# Altium schematic sheet ESQUEMATICOS1.SchDoc (part 2 of 2)
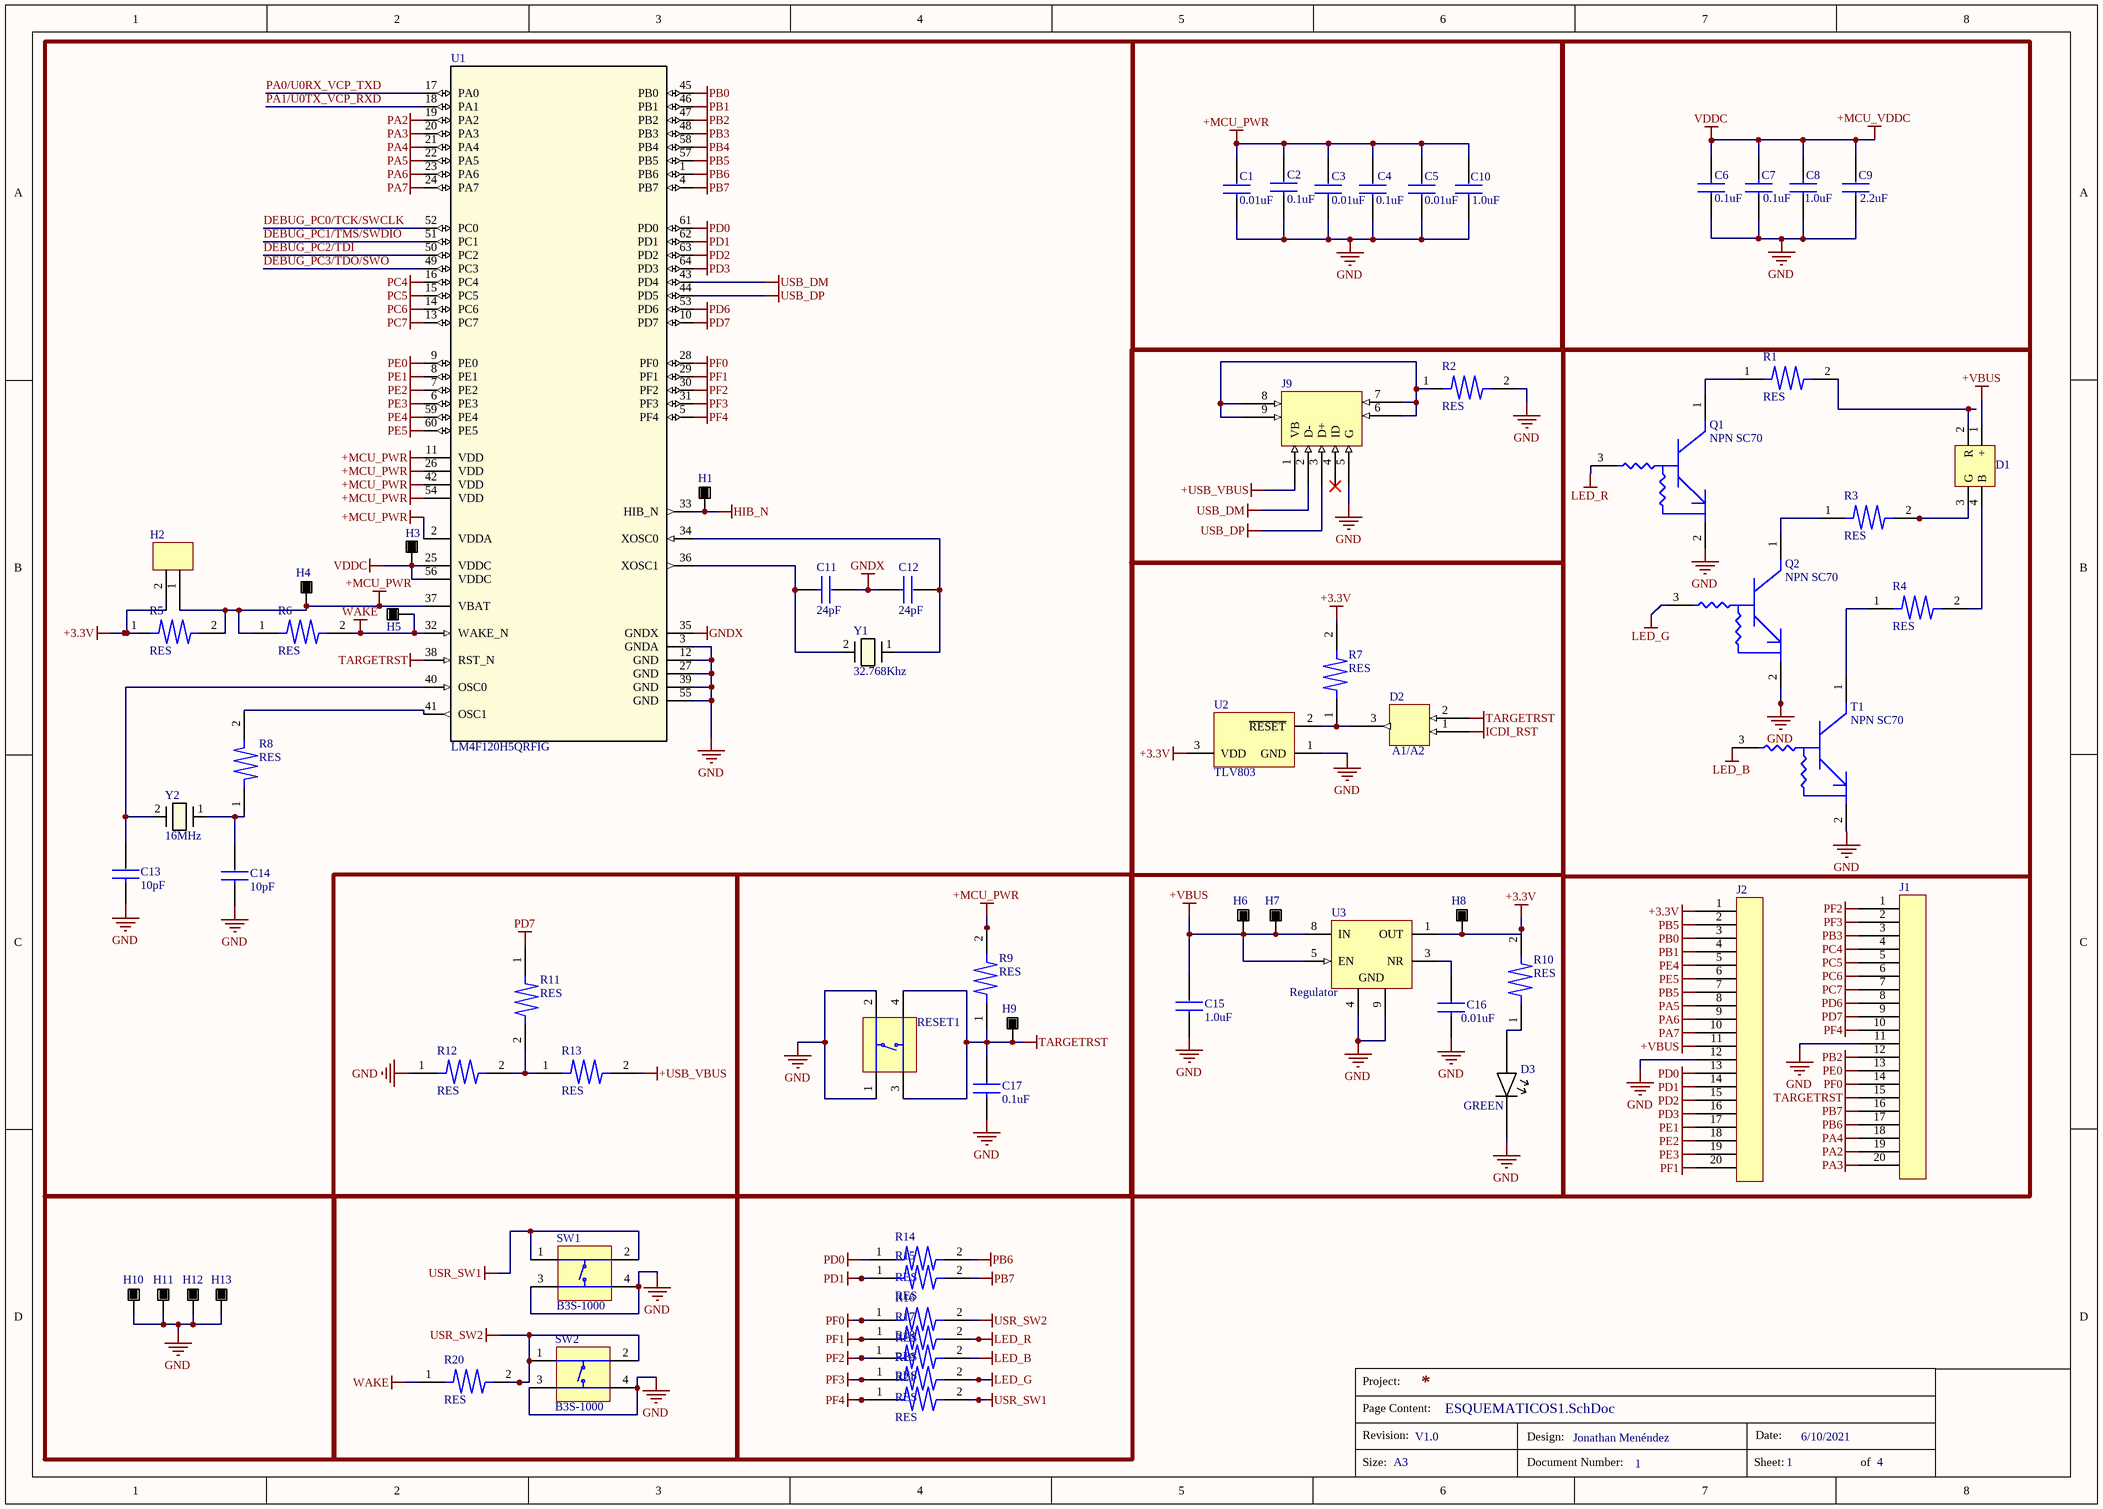
[diagram p1: ESQUEMATICOS1.SchDoc]

## Library data of the parts
C1 C3 C5 C16 = TMK105B7103KV-F: 0402 0.01 uF 25 V ±10% X7R Automotive Multilayer Ceramic Capacitor; Manufacturer: Taiyo Yuden; Capacitance: 10nF; Voltage Rating: 25V; Supplier 1: Digi-Key; Manufacturer Part Number: TMK105B7103KV-F; Stock 1: 711807; Pricing 1: 1 = 0.10000, 10 = 0.02200, 50 = 0.01180, 100 = 0.00960, 500 = 0.00684, 1000 = 0.00538, 2500 = 0.00489, 5000 = 0.00450 (USD); RoHS: Yes; Mount: Surface Mount; Case/Package: 0402; Case Code (Metric): 1005; Case Code (Imperial): 0402; Contact Plating: Tin; Min Operating Temperature: -55°C; Max Operating Temperature: 125°C; Tolerance: 10%; Package Quantity: 1; Packaging: Tape and Reel; Voltage Rating (DC): 25V; Dielectric: X7R; Termination: SMD/SMT; Resistor Type: Ceramic; Series: M; Construction: Flat; Voltage: 25V; Length: 1mm; Width: 0.02inch; Height: 0.5mm; Thickness: 0.022inch; Depth: 0.5mm; REACH SVHC: Unknown; Halogen Free: Halogen Free; RoHS Compliant: Yes; ComponentLink1URL: https://datasheet.ciiva.com/129/tmk105b7103kv-f-ss-129699.pdf?src-supplier=Digi-Key; ComponentLink1Description: https://datasheet.ciiva.com/129/tmk105b7103kv-f-ss-129699.pdf?src-supplier=Digi-Key; ComponentLink2URL: https://datasheet.ciiva.com/30192/438tmk105b7103kv-f-30192315.pdf?src-supplier=Onlinecomponents.com; ComponentLink2Description: https://datasheet.ciiva.com/30192/438tmk105b7103kv-f-30192315.pdf?src-supplier=Onlinecomponents.com; ComponentLink3URL: https://datasheet.ciiva.com/15922/204tmk105b7103kv-f-15922348.pdf?src-supplier=Onlinecomponents.com; ComponentLink3Description: https://datasheet.ciiva.com/15922/204tmk105b7103kv-f-15922348.pdf?src-supplier=Onlinecomponents.com; ComponentLink4URL: https://datasheet.ciiva.com/30156/190tmk105b7103kv-f-30156174.pdf?src-supplier=Onlinecomponents.com; ComponentLink4Description: https://datasheet.ciiva.com/30156/190tmk105b7103kv-f-30156174.pdf?src-supplier=Onlinecomponents.com; ComponentLink5URL: https://datasheet.ciiva.com/28645/746258-28645254.pdf?src-supplier=Element14; ComponentLink5Description: https://datasheet.ciiva.com/28645/746258-28645254.pdf?src-supplier=Element14; ComponentLink6URL: https://datasheet.ciiva.com/7975/746258-7975835.pdf?src-supplier=Element14; ComponentLink6Description: https://datasheet.ciiva.com/7975/746258-7975835.pdf?src-supplier=Element14; Supplier Part Number 1: 587-1223-1-ND
C2 C4 C6 C7 C10 C17 = EMK105B7104KV-F: 0402 0.1 uF 16 V ±10% Tolerance X7R Multilayer Ceramic Chip Capacitor; Manufacturer: Taiyo Yuden; Capacitance: 100nF; Voltage Rating (DC): 16V; Supplier 1: Digi-Key; Manufacturer Part Number: EMK105B7104KV-F; Stock 1: 4; Pricing 1: 1 = 0.10000, 10 = 0.02400, 50 = 0.01320, 100 = 0.01070, 500 = 0.00764, 1000 = 0.00601, 2500 = 0.00546, 5000 = 0.00503 (USD); RoHS: Yes; Mount: Surface Mount; Case/Package: 0402; Number of Pins: 2; Case Code (Metric): 1005; Case Code (Imperial): 0402; Min Operating Temperature: -55°C; Max Operating Temperature: 125°C; Tolerance: 10%; Packaging: Tape and Reel; Dielectric: X7R; Package Quantity: 1; Voltage Rating: 16V; Termination: SMD/SMT; Series: M; Construction: Flat; Resistor Type: Ceramic; Length: 1mm; Width: 0.02inch; Height: 0.5mm; Thickness: 0.022inch; Depth: 0.5mm; Radiation Hardening: No; Halogen Free: Halogen Free; REACH SVHC: Unknown; RoHS Compliant: Yes; Lead Free: Lead Free; ComponentLink1URL: https://datasheet.ciiva.com/129/emk105b7104kv-f-ss-129714.pdf?src-supplier=Digi-Key; ComponentLink1Description: https://datasheet.ciiva.com/129/emk105b7104kv-f-ss-129714.pdf?src-supplier=Digi-Key; ComponentLink2URL: https://datasheet.ciiva.com/30227/emk105b7104kv-f-30227394.pdf?src-supplier=Onlinecomponents.com; ComponentLink2Description: https://datasheet.ciiva.com/30227/emk105b7104kv-f-30227394.pdf?src-supplier=Onlinecomponents.com; ComponentLink3URL: https://datasheet.ciiva.com/22748/746258-22748959.pdf?src-supplier=Element14; ComponentLink3Description: https://datasheet.ciiva.com/22748/746258-22748959.pdf?src-supplier=Element14; Supplier Part Number 1: 587-1451-1-ND
C8 C15 = 100R07X105KV4T: Multilayer Ceramic Capacitor, Tanceram Series, 1 - F, - 10%, X5R, 10 V, 0402 [1005 Metric]; Manufacturer: Johanson; Capacitance: 1uF; Voltage Rating: 10V; Supplier 1: Mouser; Manufacturer Part Number: 100R07X105KV4T; Stock 1: 57482; Pricing 1: 1 = 0.28000, 10 = 0.19300, 50 = 0.19300, 100 = 0.09800, 1000 = 0.06000, 10000 = 0.04800 (USD); RoHS: Yes; Mount: Surface Mount; Case/Package: 0402; Number of Pins: 2; Case Code (Metric): 1005; Case Code (Imperial): 0402; Weight: 2.3E-05oz; Min Operating Temperature: -55°C; Max Operating Temperature: 85°C; Tolerance: 10%; Packaging: Tape and Reel; Package Quantity: 10000; Voltage Rating (DC): 10V; Dielectric: X5R; Termination: SMD/SMT; Series: TANCERAM®; Length: 1.02mm; Width: 0.02inch; Height: 0.64mm; Thickness: 0.025inch; Depth: 0.51mm; Radiation Hardening: No; REACH SVHC: No SVHC; RoHS Compliant: Yes; ComponentLink1URL: https://datasheet.ciiva.com/26948/getdatasheetpartid-789067-26948543.pdf?src-supplier=Verical; ComponentLink1Description: https://datasheet.ciiva.com/26948/getdatasheetpartid-789067-26948543.pdf?src-supplier=Verical; ComponentLink2URL: https://datasheet.ciiva.com/22693/jdi-full-catalog-2012-01-22693744.pdf?src-supplier=Element14; ComponentLink2Description: https://datasheet.ciiva.com/22693/jdi-full-catalog-2012-01-22693744.pdf?src-supplier=Element14; Supplier Part Number 1: 605-100R07X105KV4T
C9 = GRM188R61C225KE15D: 0603 2.2 uF 16 V ±10% Tolerance X5R SMT Multilayer Ceramic Capacitor; Manufacturer: Murata; Voltage Rating: 16V; Supplier 1: Arrow Electronics; Manufacturer Part Number: GRM188R61C225KE15D; Stock 1: 64000; Pricing 1: 4000 = 0.08280, 8000 = 0.07540, 12000 = 0.06280, 20000 = 0.05900, 24000 = 0.05760, 100000 = 0.05710 (USD); RoHS: Yes; Mount: Surface Mount; Case/Package: 0603; Case Code (Imperial): 0603; Case Code (Metric): 1608; Material: Ceramic; Min Operating Temperature: -55°C; Max Operating Temperature: 85°C; Capacitance: 2.2uF; Tolerance: 10%; Dielectric: X5R; Voltage Rating (DC): 16V; Packaging: Tape and Reel; Package Quantity: 1; Termination: SMD/SMT; Voltage: 16V; Length: 1.6mm; Width: 0.8mm; Height: 0.8mm; Thickness: 0.035inch; Depth: 0.8mm; Radiation Hardening: No; RoHS Compliant: Yes; Lead Free: Lead Free; REACH SVHC: No SVHC; ComponentLink1URL: https://datasheet.ciiva.com/135/grm188r61c225ke15-01-135062.pdf?src-supplier=Digi-Key; ComponentLink1Description: https://datasheet.ciiva.com/135/grm188r61c225ke15-01-135062.pdf?src-supplier=Digi-Key; ComponentLink2URL: https://datasheet.ciiva.com/135/grm188r61c225ke15-01-135063.pdf?src-supplier=Digi-Key; ComponentLink2Description: https://datasheet.ciiva.com/135/grm188r61c225ke15-01-135063.pdf?src-supplier=Digi-Key; ComponentLink3URL: https://datasheet.ciiva.com/5417/product-5417088.pdf?src-supplier=Mouser; ComponentLink3Description: https://datasheet.ciiva.com/5417/product-5417088.pdf?src-supplier=Mouser; ComponentLink4URL: https://datasheet.ciiva.com/3777/147grm188r61c225ke1523-3777042.pdf?src-supplier=Arrow+Electronics; ComponentLink4Description: https://datasheet.ciiva.com/3777/147grm188r61c225ke1523-3777042.pdf?src-supplier=Arrow+Electronics; ComponentLink5URL: https://datasheet.ciiva.com/29199/454457-da-01-en-vs-kondensator-0603-29199689.pdf?src-supplier=Conrad; ComponentLink5Description: https://datasheet.ciiva.com/29199/454457-da-01-en-vs-kondensator-0603-29199689.pdf?src-supplier=Conrad; ComponentLink6URL: https://datasheet.ciiva.com/135/grm188r61c225ke15-01-135061.pdf?src-supplier=Digi-Key; ComponentLink6Description: https://datasheet.ciiva.com/135/grm188r61c225ke15-01-135061.pdf?src-supplier=Digi-Key; ComponentLink7URL: https://datasheet.ciiva.com/16369/product-16369274.pdf?src-supplier=Future+Electronics; ComponentLink7Description: https://datasheet.ciiva.com/16369/product-16369274.pdf?src-supplier=Future+Electronics; Supplier Part Number 1: GRM188R61C225KE15D
C11 C12 = C1005C0G1H240J: Capacitor Ceramic 24PF 50V, C0G, 5%, 0402, Full Reel; Manufacturer: TDK; Supplier 1: Newark; Manufacturer Part Number: C1005C0G1H240J; Stock 1: 0; RoHS: Yes; Mount: Surface Mount; Case/Package: 0402; Number of Pins: 2; Case Code (Metric): 1005; Case Code (Imperial): 0402; Dielectric Material: Ceramic; Min Operating Temperature: -55°C; Max Operating Temperature: 125°C; Package Quantity: 1; Capacitance: 24pF; Voltage Rating: 50V; Tolerance: 5%; Packaging: Tape and Reel; Voltage Rating (DC): 50V; Dielectric: C0G; Termination: SMD/SMT; Resistor Type: Ceramic; Series: C; Construction: Flat; Length: 0.039inch; Width: 0.02inch; Height: 0.5mm; Thickness: 0.022inch; ComponentLink1URL: https://datasheet.ciiva.com/161/c-series-generalappl-b11-161778.pdf?src-supplier=Digi-Key; ComponentLink1Description: https://datasheet.ciiva.com/161/c-series-generalappl-b11-161778.pdf?src-supplier=Digi-Key; ComponentLink2URL: https://datasheet.ciiva.com/161/c-series-generalappl-b11-161779.pdf?src-supplier=Digi-Key; ComponentLink2Description: https://datasheet.ciiva.com/161/c-series-generalappl-b11-161779.pdf?src-supplier=Digi-Key; ComponentLink3URL: https://datasheet.ciiva.com/161/c-series-generalappl-b11-161780.pdf?src-supplier=Digi-Key; ComponentLink3Description: https://datasheet.ciiva.com/161/c-series-generalappl-b11-161780.pdf?src-supplier=Digi-Key; ComponentLink4URL: https://datasheet.ciiva.com/5418/mlcc-commercial-general-en-5418382.pdf?src-supplier=Mouser; ComponentLink4Description: https://datasheet.ciiva.com/5418/mlcc-commercial-general-en-5418382.pdf?src-supplier=Mouser; Supplier Part Number 1: 87R3204
C13 C14 = GRM1555C1H100JZ01D: Cap Ceramic 10pF 50V C0G 5% SMD 0402 125°C Paper T/R; Manufacturer: Murata; Insulation Resistance: 10GR; Temperature Coefficient: 30ppm/°C; Supplier 1: Farnell; Manufacturer Part Number: GRM1555C1H100JZ01D; Stock 1: 0; Pricing 1: 1 = 37.68000, 3 = 28.53000 (GBP); RoHS: Yes; Mount: Surface Mount; Case/Package: 0402; Number of Pins: 2; Case Code (Imperial): 0402; Case Code (Metric): 1005; Dielectric Material: Ceramic; Min Operating Temperature: -55°C; Max Operating Temperature: 125°C; Capacitance: 10pF; Tolerance: 5%; Dielectric: C0G; Voltage Rating: 50V; Voltage Rating (DC): 50V; Packaging: Tape and Reel; Package Quantity: 1; Termination: SMD/SMT; Voltage: 50V; Series: GRM; Construction: Flat; Length: 1mm; Width: 0.5mm; Height: 0.5mm; Thickness: 0.022inch; Depth: 0.5mm; Size: 0.5mm; Radiation Hardening: No; REACH SVHC: No SVHC; Lead Free: Lead Free; RoHS Compliant: Yes; ComponentLink1URL: https://datasheet.ciiva.com/129/partnumbering-e-01-129819.pdf?src-supplier=Digi-Key; ComponentLink1Description: https://datasheet.ciiva.com/129/partnumbering-e-01-129819.pdf?src-supplier=Digi-Key; ComponentLink2URL: https://datasheet.ciiva.com/129/partnumbering-e-01-129820.pdf?src-supplier=Digi-Key; ComponentLink2Description: https://datasheet.ciiva.com/129/partnumbering-e-01-129820.pdf?src-supplier=Digi-Key; ComponentLink3URL: https://datasheet.ciiva.com/129/partnumbering-e-01-129821.pdf?src-supplier=Digi-Key; ComponentLink3Description: https://datasheet.ciiva.com/129/partnumbering-e-01-129821.pdf?src-supplier=Digi-Key; ComponentLink4URL: https://datasheet.ciiva.com/19476/1855887-19476237.pdf?src-supplier=Jameco; ComponentLink4Description: https://datasheet.ciiva.com/19476/1855887-19476237.pdf?src-supplier=Jameco; ComponentLink5URL: https://datasheet.ciiva.com/18184/getdatasheetpartid-91958-18184166.pdf?src-supplier=Verical; ComponentLink5Description: https://datasheet.ciiva.com/18184/getdatasheetpartid-91958-18184166.pdf?src-supplier=Verical; ComponentLink6URL: https://datasheet.ciiva.com/11787/0900766b807a1cab-11787097.pdf?src-supplier=RSComponents; ComponentLink6Description: https://datasheet.ciiva.com/11787/0900766b807a1cab-11787097.pdf?src-supplier=RSComponents; ComponentLink7URL: https://datasheet.ciiva.com/6068/1747431-6068159.pdf?src-supplier=Farnell; ComponentLink7Description: https://datasheet.ciiva.com/6068/1747431-6068159.pdf?src-supplier=Farnell; ComponentLink8URL: https://datasheet.ciiva.com/11607/c02e-11607480.pdf?src-supplier=Avnet; ComponentLink8Description: https://datasheet.ciiva.com/11607/c02e-11607480.pdf?src-supplier=Avnet; ComponentLink9URL: https://datasheet.ciiva.com/14116/grmseries-tc-hitype-eng-14116856.pdf?src-supplier=Distrelec; ComponentLink9Description: https://datasheet.ciiva.com/14116/grmseries-tc-hitype-eng-14116856.pdf?src-supplier=Distrelec; ComponentLink10URL: https://datasheet.ciiva.com/14116/grmseries-tc-hitype-eng-14116917.pdf?src-supplier=Distrelec; ComponentLink10Description: https://datasheet.ciiva.com/14116/grmseries-tc-hitype-eng-14116917.pdf?src-supplier=Distrelec; ComponentLink11URL: https://datasheet.ciiva.com/7828/1747431-7828813.pdf?src-supplier=Element14; ComponentLink11Description: https://datasheet.ciiva.com/7828/1747431-7828813.pdf?src-supplier=Element14; ComponentLink12URL: https://datasheet.ciiva.com/7828/1747431-7828815.pdf?src-supplier=Element14; ComponentLink12Description: https://datasheet.ciiva.com/7828/1747431-7828815.pdf?src-supplier=Element14; Supplier Part Number 1: 1118131
D1 = 18-038/RSGHBHC1-S02/2T: LED Tri-Color Blue/Green/Red 475nm/531nm/631nm Chip LED 4-Pin SMD T/R; Manufacturer: Everlight; Manufacturer Part Number: 18-038/RSGHBHC1-S03/2T; Color: Blue,Green,Red; Lens Style: Clear; Forward Voltage: 3.3V; Supplier 1: Avnet; Stock 1: 0; RoHS: No; Lead Free: Lead Free; ComponentLink1URL: http://www.everlight.com/datasheets/18-038-RSGHBHC1-S01-2T.pdf?src-supplier=Avnet; ComponentLink1Description: http://www.everlight.com/datasheets/18-038-RSGHBHC1-S01-2T.pdf?src-supplier=Avnet; Supplier Part Number 1: 18-038/RSGHBHC1-S03-2T
D2 = BAS70W-05-7-F: BAS70W Series 70 V 70 mA Surface Mount Schottky Barrier Diode - SOT-323; Manufacturer: Diodes; Element Configuration: Common Cathode; Forward Current: 70mA; Reverse Recovery Time: 5ns; Max Repetitive Reverse Voltage (Vrrm): 70V; Peak Non-Repetitive Surge Current: 100mA; Max Power Dissipation: 200mW; Forward Voltage: 1V; Max Reverse Current: 100nA; Capacitance: 2pF; Supplier 1: RSComponents; Manufacturer Part Number: BAS70W-05-7-F; Stock 1: 400; Pricing 1: 600 = 0.14900, 1500 = 0.11400 (GBP); RoHS: Yes; Mount: Surface Mount; Case/Package: SOT-323; Number of Pins: 3; Weight: 0.000212oz; Contact Plating: Tin,Matte; Min Operating Temperature: -55°C; Max Operating Temperature: 125°C; Packaging: Tape and Reel; Package Quantity: 3000; Average Rectified Current: 70mA; Max Forward Surge Current (Ifsm): 100mA; Power Dissipation: 200mW; Termination: SMD/SMT; Current Rating: 70mA; Power Rating: 200mW; Voltage Rating (DC): 70V; Max Reverse Voltage (DC): 70V; Series: -; Length: 2.2mm; Width: 1.35mm; Height: 1mm; Radiation Hardening: No; Lead Free: Lead Free; RoHS Compliant: Yes; ComponentLink1URL: https://datasheet.ciiva.com/8303/ds30113-8303106.pdf?src-supplier=Avnet; ComponentLink1Description: https://datasheet.ciiva.com/8303/ds30113-8303106.pdf?src-supplier=Avnet; ComponentLink2URL: https://datasheet.ciiva.com/4715/ds30113-42118-4715778.pdf?src-supplier=Mouser; ComponentLink2Description: https://datasheet.ciiva.com/4715/ds30113-42118-4715778.pdf?src-supplier=Mouser; ComponentLink3URL: https://datasheet.ciiva.com/16574/ds30113-16574275.pdf?src-supplier=Avnet+Europe; ComponentLink3Description: https://datasheet.ciiva.com/16574/ds30113-16574275.pdf?src-supplier=Avnet+Europe; ComponentLink4URL: https://datasheet.ciiva.com/6388/ds30113-6388462.pdf?src-supplier=Digi-Key; ComponentLink4Description: https://datasheet.ciiva.com/6388/ds30113-6388462.pdf?src-supplier=Digi-Key; Supplier Part Number 1: 7513342P
D3 = LTST-C171GKT: Green 0805 130 º Min 5 mcd Typical 12 mcd Water Clear Lens SMT LED; Manufacturer: Vishay Lite-On; Lens Color: Colorless; Viewing Angle: 130°; Lens Style: Diffused,Colorless,Rectangular,Clear; Luminous Intensity: 12mcd; Forward Current: 30mA; Forward Voltage: 2.1V; Power Rating: 100mW; Dominant Wavelength: 569nm; Test Current: 10mA; Number of Elements: 1; Wavelength: 585nm; Reverse Voltage: 5V; Supplier 1: RSComponents; Manufacturer Part Number: LTST-C171GKT; Stock 1: 50050; Pricing 1: 250 = 0.05300, 500 = 0.05100, 1250 = 0.04300, 2500 = 0.04100 (GBP); RoHS: Yes; Mount: Surface Mount; Case/Package: 0805; Number of Pins: 2; Color: Green; Case Code (Metric): 2012; Case Code (Imperial): 0805; Min Operating Temperature: -55°C; Max Operating Temperature: 85°C; Package Quantity: 1; Packaging: Tape and Reel; Illumination Color: Green; Lens Transparency: Clear; Power Dissipation: 100mW; Number of LEDs: 1; Series: CHIPLED 0805; Length: 2mm; Width: 1.25mm; Height: 0.8mm; Depth: 1.25mm; Radiation Hardening: No; Lead Free: Lead Free; RoHS Compliant: Yes; ComponentLink1URL: https://datasheet.ciiva.com/2110/ltst-c171gkt-2110000.pdf?src-supplier=Digi-Key; ComponentLink1Description: https://datasheet.ciiva.com/2110/ltst-c171gkt-2110000.pdf?src-supplier=Digi-Key; ComponentLink2URL: https://datasheet.ciiva.com/11773/0900766b80dc0296-11773991.pdf?src-supplier=RSComponents; ComponentLink2Description: https://datasheet.ciiva.com/11773/0900766b80dc0296-11773991.pdf?src-supplier=RSComponents; ComponentLink3URL: https://datasheet.ciiva.com/12400/lite-on-ltst-c171gkt-190133-12400647.pdf?src-supplier=Mouser; ComponentLink3Description: https://datasheet.ciiva.com/12400/lite-on-ltst-c171gkt-190133-12400647.pdf?src-supplier=Mouser; ComponentLink4URL: https://datasheet.ciiva.com/2110/ltst-c171gkt-2110001.pdf?src-supplier=Digi-Key; ComponentLink4Description: https://datasheet.ciiva.com/2110/ltst-c171gkt-2110001.pdf?src-supplier=Digi-Key; ComponentLink5URL: https://datasheet.ciiva.com/2110/ltst-c171gkt-2110002.pdf?src-supplier=Digi-Key; ComponentLink5Description: https://datasheet.ciiva.com/2110/ltst-c171gkt-2110002.pdf?src-supplier=Digi-Key; ComponentLink6URL: https://datasheet.ciiva.com/16396/ltst-c171gkt-16396549.pdf?src-supplier=Future+Electronics; ComponentLink6Description: https://datasheet.ciiva.com/16396/ltst-c171gkt-16396549.pdf?src-supplier=Future+Electronics; Supplier Part Number 1: 6920935P
H1 H3-H13 = Single Head: Connector
H2 = 961102-6404-AR: Header; PinStrip; CopperAlloy; HighTempThermoplastic; 2Cnts; 2A; Str; 961Series; Manufacturer: 3M; Number of Positions: 2; Gender: Male; Pitch: 2.54mm; Contact Post Length: 3.3mm; Supplier 1: Digi-Key; Manufacturer Part Number: 961102-6404-AR; Stock 1: 7305; Pricing 1: 1 = 0.22000, 10 = 0.21000, 25 = 0.17920, 50 = 0.15680, 100 = 0.14560, 250 = 0.12880, 500 = 0.12320 (USD); RoHS: Yes; Mount: Through Hole; Contact Plating: Gold; Contact Material: Copper Alloy,Copper; Color: Black; Housing Color: Black; Housing Material: Thermoplastic; Contact Shape: Square; Contact Finish - Mating: GOLD; Insulation Material: Thermoplastic; Insulation Color: Black; Min Operating Temperature: -25°C; Max Operating Temperature: 105°C; Number of Rows: 1; Max Current Rating: 2A; Package Quantity: 3000; Packaging: Bulk; Contact Gender: Male; Current Rating: 2A; Termination: Solder; Number of Contacts: 2; Orientation: Straight; Connector Type: Header; Fastening Type: Pull; Series: 961; Contact Type: Male Pin; Length: 5.08mm; Contact Mating Length: 0.22inch; Depth: 2.5mm; REACH SVHC: Unknown; Flammability Rating: UL94 V-0; RoHS Compliant: Yes; ComponentLink1URL: https://datasheet.ciiva.com/731/ts2181-731431.pdf?src-supplier=Digi-Key; ComponentLink1Description: https://datasheet.ciiva.com/731/ts2181-731431.pdf?src-supplier=Digi-Key; ComponentLink2URL: https://datasheet.ciiva.com/5724/ts2181-5724889.pdf?src-supplier=Farnell; ComponentLink2Description: https://datasheet.ciiva.com/5724/ts2181-5724889.pdf?src-supplier=Farnell; ComponentLink3URL: https://datasheet.ciiva.com/7997/ts2181-7997272.pdf?src-supplier=Element14; ComponentLink3Description: https://datasheet.ciiva.com/7997/ts2181-7997272.pdf?src-supplier=Element14; ComponentLink4URL: https://datasheet.ciiva.com/14617/70237733-14617125.pdf?src-supplier=Allied+Electronics; ComponentLink4Description: https://datasheet.ciiva.com/14617/70237733-14617125.pdf?src-supplier=Allied+Electronics; ComponentLink5URL: https://datasheet.ciiva.com/46428/1794052-46428554.pdf?src-supplier=Element14; ComponentLink5Description: https://datasheet.ciiva.com/46428/1794052-46428554.pdf?src-supplier=Element14; Supplier Part Number 1: 3M9457-02-ND
J1 J2 = SSW-110-23-S-D: Tiger Buy Socket Strip With Pcb Tails, 0.100" Pitch Rohs Compliant: Yes; Manufacturer: Samtec; Number of Contacts: 20; Gender: Female; Pitch: 2.54mm; Supplier 1: RSComponents; Manufacturer Part Number: SSW-110-23-S-D; Stock 1: 57; Pricing 1: 1 = 2.83000, 10 = 2.59000, 50 = 2.44000, 100 = 2.30000, 250 = 2.07000 (GBP); RoHS: Yes; Mount: Through Hole; Contact Plating: Gold; Number of Rows: 2; Packaging: Bulk; Termination: Solder; Radiation Hardening: No; RoHS Compliant: Yes; ComponentLink1URL: ftp://ftp.samtec.com/webfiles/PDF/SSQ_TH.PDF?src-supplier=Avnet; ComponentLink1Description: ftp://ftp.samtec.com/webfiles/PDF/SSQ_TH.PDF?src-supplier=Avnet; Supplier Part Number 1: 2079196
J9 = ZX62-B-5PA(11): Conn Micro USB 2.0 Type B RCP 5 POS 0.65mm Solder RA SMD 5 Terminal 1 Port T/R; Manufacturer: Hirose; Number of Terminals/Pins: 5; Connector Type: USB,Receptacle; Gender: Receptacle; Current Rating: 1A; Mating Cycles: 10000; Voltage Rating: 30V; Number of Ports: 1; USB Standard: USB 2.0; Supplier 1: Farnell; Manufacturer Part Number: ZX62-B-5PA(11); Stock 1: 0; Pricing 1: 10 = 0.60800, 50 = 0.48000, 100 = 0.44900, 250 = 0.43000, 500 = 0.39100, 1000 = 0.35900 (GBP); RoHS: Yes; Mount: Surface Mount,Horizontal; Contact Plating: Gold; Contact Material: Copper Alloy; Min Operating Temperature: -30°C; Max Operating Temperature: 85°C; Packaging: Tape and Reel; Number of Contacts: 5; Package Quantity: 3500; Series: ZX62; Termination: Solder; Orientation: Right Angle; Number of Positions: 5; Max Voltage Rating (AC): 30V; Voltage Rating (AC): 30V; Length: 7.9mm; Pitch: 0.65mm; Depth: 5.6mm; Radiation Hardening: No; RoHS Compliant: Yes; REACH SVHC: No SVHC; Lead Free: Lead Free; Flammability Rating: UL94 V-0; ComponentLink1URL: https://datasheet.ciiva.com/11731/0900766b80d9c4df-11731324.pdf?src-supplier=RSComponents; ComponentLink1Description: https://datasheet.ciiva.com/11731/0900766b80d9c4df-11731324.pdf?src-supplier=RSComponents; ComponentLink2URL: https://datasheet.ciiva.com/15181/getdatasheetpartid-449685-15181366.pdf?src-supplier=Verical; ComponentLink2Description: https://datasheet.ciiva.com/15181/getdatasheetpartid-449685-15181366.pdf?src-supplier=Verical; ComponentLink3URL: https://datasheet.ciiva.com/7646/81390-7646778.pdf?src-supplier=Element14; ComponentLink3Description: https://datasheet.ciiva.com/7646/81390-7646778.pdf?src-supplier=Element14; Supplier Part Number 1: 1645325
Q1 Q2 T1 = DTC114EET1G: DTC114EET1G NPN Digi Transistor; 100mA 50 V 10 kOhm; Ratio Of 1; 3-Pin SOT-416; Manufacturer: ON Semiconductor; Collector Emitter Voltage (VCEO): 50V; Element Configuration: Single; hFE Min: 35; Max Power Dissipation: 200mW; Collector-emitter Voltage-Max: 250mV; Current Rating: 70mA; Output Voltage: 300mV; Supplier 1: Digi-Key; Manufacturer Part Number: DTC114EET1G; Stock 1: 0; Pricing 1: 1 = 0.19000, 10 = 0.17300, 100 = 0.09400, 500 = 0.05784, 1000 = 0.03943 (USD); RoHS: Yes; Case/Package: SOT-416; Number of Pins: 3; Contact Plating: Tin,Matte; Min Operating Temperature: -55°C; Max Operating Temperature: 150°C; Package Quantity: 1; Packaging: Tape and Reel; Max Collector Current: 100mA; Collector Emitter Breakdown Voltage: 50V; Polarity: NPN; Series: -; Max Output Current: 100mA; Operating Supply Voltage: 50V; Max Breakdown Voltage: 50V; Continuous Collector Current: 100mA; Collector Emitter Saturation Voltage: 250mV; Voltage Rating (DC): 50V; Length: 1.6mm; Width: 0.8mm; Height: 0.75mm; Radiation Hardening: No; RoHS Compliant: Yes; Lead Free: Lead Free; Halogen Free: Halogen Free; REACH SVHC: No SVHC; ComponentLink1URL: https://datasheet.ciiva.com/15139/getdatasheetpartid-32044-15139553.pdf?src-supplier=Verical; ComponentLink1Description: https://datasheet.ciiva.com/15139/getdatasheetpartid-32044-15139553.pdf?src-supplier=Verical; ComponentLink2URL: https://datasheet.ciiva.com/989/dtc114e-d-989078.pdf?src-supplier=Digi-Key; ComponentLink2Description: https://datasheet.ciiva.com/989/dtc114e-d-989078.pdf?src-supplier=Digi-Key; ComponentLink3URL: https://datasheet.ciiva.com/989/dtc114e-d-989079.pdf?src-supplier=Digi-Key; ComponentLink3Description: https://datasheet.ciiva.com/989/dtc114e-d-989079.pdf?src-supplier=Digi-Key; ComponentLink4URL: https://datasheet.ciiva.com/989/dtc114e-d-989080.pdf?src-supplier=Digi-Key; ComponentLink4Description: https://datasheet.ciiva.com/989/dtc114e-d-989080.pdf?src-supplier=Digi-Key; ComponentLink5URL: https://datasheet.ciiva.com/11210/dtc124e-d-11210255.pdf?src-supplier=Avnet; ComponentLink5Description: https://datasheet.ciiva.com/11210/dtc124e-d-11210255.pdf?src-supplier=Avnet; ComponentLink6URL: https://datasheet.ciiva.com/16349/dtc114e-d-16349642.pdf?src-supplier=Future+Electronics; ComponentLink6Description: https://datasheet.ciiva.com/16349/dtc114e-d-16349642.pdf?src-supplier=Future+Electronics; ComponentLink7URL: https://datasheet.ciiva.com/22661/1813827-22661178.pdf?src-supplier=Element14; ComponentLink7Description: https://datasheet.ciiva.com/22661/1813827-22661178.pdf?src-supplier=Element14; Supplier Part Number 1: DTC114EET1GOSDKR-ND
R1 R3 R4 R10 R20 = RC0402FR-07330RL: Res Thick Film 0402 330 Ohm 1% 0.063W(1/16W) ±100ppm/C Pad SMD T/R; Manufacturer: Yageo; Resistance: 330R; Temperature Coefficient: 100ppm/°C; Power Rating: 62.5mW; Voltage Rating: 50V; Max Power Dissipation: 63mW; Supplier 1: Digi-Key; Manufacturer Part Number: RC0402FR-07330RL; Stock 1: 664783; Pricing 1: 1 = 0.10000, 10 = 0.01600, 100 = 0.00660, 1000 = 0.00299, 2500 = 0.00259, 5000 = 0.00214 (USD); RoHS: Yes; Case/Package: 0402; Case Code (Metric): 1005; Case Code (Imperial): 0402; Size Code: 0402; Min Operating Temperature: -55°C; Max Operating Temperature: 155°C; Packaging: Tape and Reel; Tolerance: 1%; Package Quantity: 1; Resistor Type: Thick Film; Number of Terminations: 2; Termination: SMD/SMT; Features: Moisture Resistant; Series: RC; Construction: Rectangular; Technology: THICK FILM; Resistance Tolerance: 1%; Length: 0.039inch; Width: 0.02inch; Height: 0.016inch; Depth: 0.5mm; RoHS Compliant: Yes; REACH SVHC: Unknown; Military Standard: Not; Lead Free: Lead Free; ComponentLink1URL: https://datasheet.ciiva.com/11819/0900766b80c66297-11819490.pdf?src-supplier=RSComponents; ComponentLink1Description: https://datasheet.ciiva.com/11819/0900766b80c66297-11819490.pdf?src-supplier=RSComponents; ComponentLink2URL: https://datasheet.ciiva.com/12656/pyu-rc0402-51-rohs-l-6-r-12656815.pdf?src-supplier=Mouser; ComponentLink2Description: https://datasheet.ciiva.com/12656/pyu-rc0402-51-rohs-l-6-r-12656815.pdf?src-supplier=Mouser; ComponentLink3URL: https://datasheet.ciiva.com/2453/pyu-r-int-thick-7-2453661.pdf?src-supplier=Digi-Key; ComponentLink3Description: https://datasheet.ciiva.com/2453/pyu-r-int-thick-7-2453661.pdf?src-supplier=Digi-Key; ComponentLink4URL: https://datasheet.ciiva.com/2453/pyu-r-int-thick-7-2453662.pdf?src-supplier=Digi-Key; ComponentLink4Description: https://datasheet.ciiva.com/2453/pyu-r-int-thick-7-2453662.pdf?src-supplier=Digi-Key; ComponentLink5URL: https://datasheet.ciiva.com/2453/pyu-r-int-thick-7-2453663.pdf?src-supplier=Digi-Key; ComponentLink5Description: https://datasheet.ciiva.com/2453/pyu-r-int-thick-7-2453663.pdf?src-supplier=Digi-Key; ComponentLink6URL: https://datasheet.ciiva.com/7849/1018594-7849962.pdf?src-supplier=Element14; ComponentLink6Description: https://datasheet.ciiva.com/7849/1018594-7849962.pdf?src-supplier=Element14; ComponentLink7URL: https://datasheet.ciiva.com/7849/1018594-7849963.pdf?src-supplier=Element14; ComponentLink7Description: https://datasheet.ciiva.com/7849/1018594-7849963.pdf?src-supplier=Element14; ComponentLink8URL: https://datasheet.ciiva.com/17083/pyu-rc0402-51-rohs-l-6-r-17083994.pdf?src-supplier=Future+Electronics; ComponentLink8Description: https://datasheet.ciiva.com/17083/pyu-rc0402-51-rohs-l-6-r-17083994.pdf?src-supplier=Future+Electronics; Supplier Part Number 1: 311-330LRCT-ND
R2 R5 R8 R11 R14-R19 R21 = ERJ-3GEY0R00V: ERJ Series 0603 0 Ohm 0.1 W Jumper Surface Mount Thick Film Chip Resistor; Manufacturer: Panasonic; Resistance: 0R; Power Rating: 100mW; Voltage Rating: 75V; Tolerance: 0%; Temperature Coefficient: 600ppm/°C; Voltage Rating (DC): 50V; Supplier 1: Future Electronics; Manufacturer Part Number: ERJ-3GEY0R00V; Stock 1: 5000; Pricing 1: 5000 = 0.01170 (USD); RoHS: Yes; Mount: Surface Mount; Case/Package: 0603; Contact Plating: Tin; Case Code (Metric): 1608; Case Code (Imperial): 0603; Size Code: 0603; Min Operating Temperature: -55°C; Max Operating Temperature: 155°C; Resistor Type: Thick Film; Packaging: Tape and Reel; Package Quantity: 1; Number of Terminations: 2; Termination: SMD/SMT; Max Power Dissipation: 100mW; Features: Automotive AEC-Q200; Series: ERJ; Construction: Rectangular; Technology: THICK FILM; Length: 1.6mm; Width: 0.031inch; Height: 0.45mm; Depth: 0.8mm; Radiation Hardening: No; REACH SVHC: No SVHC; Military Standard: Not; Lead Free: Lead Free; RoHS Compliant: Yes; ComponentLink1URL: https://datasheet.ciiva.com/11808/0900766b80f806dd-11808207.pdf?src-supplier=RSComponents; ComponentLink1Description: https://datasheet.ciiva.com/11808/0900766b80f806dd-11808207.pdf?src-supplier=RSComponents; ComponentLink2URL: https://datasheet.ciiva.com/27055/1935748-27055113.pdf?src-supplier=Jameco; ComponentLink2Description: https://datasheet.ciiva.com/27055/1935748-27055113.pdf?src-supplier=Jameco; ComponentLink3URL: https://datasheet.ciiva.com/48532/aoa0000ce1-48532165.pdf?src-supplier=Avnet; ComponentLink3Description: https://datasheet.ciiva.com/48532/aoa0000ce1-48532165.pdf?src-supplier=Avnet; ComponentLink4URL: https://datasheet.ciiva.com/5959/1678796-5959707.pdf?src-supplier=Farnell; ComponentLink4Description: https://datasheet.ciiva.com/5959/1678796-5959707.pdf?src-supplier=Farnell; ComponentLink5URL: https://datasheet.ciiva.com/43460/1678796-43460647.pdf?src-supplier=Farnell; ComponentLink5Description: https://datasheet.ciiva.com/43460/1678796-43460647.pdf?src-supplier=Farnell; ComponentLink6URL: https://datasheet.ciiva.com/9198/aoa0000ce1-9198975.pdf?src-supplier=Avnet; ComponentLink6Description: https://datasheet.ciiva.com/9198/aoa0000ce1-9198975.pdf?src-supplier=Avnet; ComponentLink7URL: https://datasheet.ciiva.com/30199/4aoa0000ce1-30199822.pdf?src-supplier=Onlinecomponents.com; ComponentLink7Description: https://datasheet.ciiva.com/30199/4aoa0000ce1-30199822.pdf?src-supplier=Onlinecomponents.com; ComponentLink8URL: https://datasheet.ciiva.com/16758/70255313-16758527.pdf?src-supplier=Allied+Electronics; ComponentLink8Description: https://datasheet.ciiva.com/16758/70255313-16758527.pdf?src-supplier=Allied+Electronics; ComponentLink9URL: https://datasheet.ciiva.com/16834/aoa0000ce1-16834828.pdf?src-supplier=Future+Electronics; ComponentLink9Description: https://datasheet.ciiva.com/16834/aoa0000ce1-16834828.pdf?src-supplier=Future+Electronics; ComponentLink10URL: https://datasheet.ciiva.com/46377/1678796-46377868.pdf?src-supplier=Element14; ComponentLink10Description: https://datasheet.ciiva.com/46377/1678796-46377868.pdf?src-supplier=Element14; ComponentLink11URL: https://datasheet.ciiva.com/28695/1678796-28695833.pdf?src-supplier=Element14; ComponentLink11Description: https://datasheet.ciiva.com/28695/1678796-28695833.pdf?src-supplier=Element14; ComponentLink12URL: https://datasheet.ciiva.com/17215/aoa0000ce1-17215388.pdf?src-supplier=Avnet+Europe; ComponentLink12Description: https://datasheet.ciiva.com/17215/aoa0000ce1-17215388.pdf?src-supplier=Avnet+Europe; Supplier Part Number 1: 9028511
R6 R12 = MCR01MRTF1004: Res Thick Film 0402 1M Ohm 1% 0.063W(1/16W) ±100ppm/C Pad SMD T/R; Manufacturer: Rohm; Resistance: 1MR; Max Power Dissipation: 63mW; Temperature Coefficient: 100ppm/°C; Voltage Rating (DC): 50V; Supplier 1: Digi-Key; Manufacturer Part Number: MCR01MRTF1004; Stock 1: 0; RoHS: Yes; Case/Package: 0402; Case Code (Metric): 1005; Case Code (Imperial): 0402; Min Operating Temperature: -55°C; Max Operating Temperature: 155°C; Package Quantity: 1; Tolerance: 1%; Packaging: Tape and Reel; Resistor Type: Thick Film; Number of Terminations: 2; Series: MCR; Length: 0.039inch; Width: 0.02inch; Height: 0.016inch; Lead Free: Lead Free; RoHS Compliant: Yes; ComponentLink1URL: https://datasheet.ciiva.com/2519/mcr01mrt-seriesspec-2519945.pdf?src-supplier=Digi-Key; ComponentLink1Description: https://datasheet.ciiva.com/2519/mcr01mrt-seriesspec-2519945.pdf?src-supplier=Digi-Key; ComponentLink2URL: https://datasheet.ciiva.com/2519/mcr01mrt-seriesspec-2519946.pdf?src-supplier=Digi-Key; ComponentLink2Description: https://datasheet.ciiva.com/2519/mcr01mrt-seriesspec-2519946.pdf?src-supplier=Digi-Key; ComponentLink3URL: https://datasheet.ciiva.com/2519/mcr01mrt-seriesspec-2519947.pdf?src-supplier=Digi-Key; ComponentLink3Description: https://datasheet.ciiva.com/2519/mcr01mrt-seriesspec-2519947.pdf?src-supplier=Digi-Key; Supplier Part Number 1: RHM1.00MCDCT-ND
R7 R9 R13 = RC0402FR-0710KL: Res General Purpose Thick Film 0402 10K Ohm 1% 1/16W ±100ppm/°C Molded SMD Paper T/R; Manufacturer: Yageo; Resistance: 10kR; Voltage Rating (DC): 50V; Power Rating: 62.5mW; Max Power Dissipation: 63mW; Supplier 1: RSComponents; Manufacturer Part Number: RC0402FR-0710KL; Stock 1: 29900; Pricing 1: 1000 = 0.03100, 2000 = 0.02800, 5000 = 0.02300 (GBP); RoHS: Yes; Case/Package: 0402; Number of Pins: 2; Case Code (Imperial): 0402; Case Code (Metric): 1005; Min Operating Temperature: -55°C; Max Operating Temperature: 155°C; Resistor Type: Thick Film; Tolerance: 1%; Temperature Coefficient: 100ppm/°C; Packaging: Tape and Reel; Voltage Rating: 50V; Termination: SMD/SMT; Working Voltage: 50V; Number of Terminations: 2; Features: Moisture Resistant; Series: RC; Resistance Tolerance: 1%; Construction: Rectangular; Length: 1mm; Width: 0.5mm; Height: 0.32mm; Depth: 0.5mm; Lead Pitch: 0.2mm; REACH SVHC: No SVHC; Lead Free: Lead Free; RoHS Compliant: Yes; Military Standard: Not; ComponentLink1URL: https://datasheet.ciiva.com/7660/38568-7660787.pdf?src-supplier=Element14; ComponentLink1Description: https://datasheet.ciiva.com/7660/38568-7660787.pdf?src-supplier=Element14; ComponentLink2URL: https://datasheet.ciiva.com/12667/pyu-rc0402-51-rohs-l-6-r-12667067.pdf?src-supplier=Mouser; ComponentLink2Description: https://datasheet.ciiva.com/12667/pyu-rc0402-51-rohs-l-6-r-12667067.pdf?src-supplier=Mouser; ComponentLink3URL: https://datasheet.ciiva.com/7849/1784430-7849813.pdf?src-supplier=Element14; ComponentLink3Description: https://datasheet.ciiva.com/7849/1784430-7849813.pdf?src-supplier=Element14; ComponentLink4URL: https://datasheet.ciiva.com/7849/1686128-7849814.pdf?src-supplier=Element14; ComponentLink4Description: https://datasheet.ciiva.com/7849/1686128-7849814.pdf?src-supplier=Element14; ComponentLink5URL: https://datasheet.ciiva.com/7849/1784430-7849815.pdf?src-supplier=Element14; ComponentLink5Description: https://datasheet.ciiva.com/7849/1784430-7849815.pdf?src-supplier=Element14; ComponentLink6URL: https://datasheet.ciiva.com/7983/1018594-7983486.pdf?src-supplier=Element14; ComponentLink6Description: https://datasheet.ciiva.com/7983/1018594-7983486.pdf?src-supplier=Element14; ComponentLink7URL: https://datasheet.ciiva.com/22747/1018594-22747512.pdf?src-supplier=Element14; ComponentLink7Description: https://datasheet.ciiva.com/22747/1018594-22747512.pdf?src-supplier=Element14; Supplier Part Number 1: 1987644P
RESET1 SW1 SW2 = B3S-1000: Switch Tactile N.O. SPST Round Button Gull Wing 0.05A 24VDC 500000Cycles 1.57N SMD Bag; Manufacturer: Omron; Actuator Color: Beige; Max Current Rating: 50mA; Contact Resistance: 100mR; Voltage Rating (DC): 24V; Illumination Type: Non-Illuminated,Illuminated; Switch Travel: 0.25mm; Switch Function: Off-Mom; Actuator Type: Standard; Number of Poles: 1; Actuator Length: 0.55mm; Ratings: IP67,Waterproof,Dust Tight; Supplier 1: Digi-Key; Manufacturer Part Number: B3S-1000; Stock 1: 0; Pricing 1: 1 = 0.70000, 10 = 0.67800, 25 = 0.65160, 100 = 0.56570, 250 = 0.51620, 500 = 0.47968, 1000 = 0.45622 (USD); RoHS: Yes; Mount: Surface Mount; Weight: 0.010582oz; Mechanical Life: 500000Cycles; Contact Plating: Silver; Contact Material: Bronze; Min Operating Temperature: -25°C; Max Operating Temperature: 70°C; Operating Force: 1.57N; Throw Configuration: SPST; Contact Current Rating: 50mA; Max Voltage Rating (DC): 24V; Package Quantity: 1500; Packaging: Bulk; Current Rating: 50mA; Termination: Gull Wing; Electrical Life: 500000Cycles; Orientation: Straight; Series: B3S; Insulation Resistance: 100MR; Length: 6.6mm; Width: 6mm; Depth: 9mm; Lead Free: Lead Free; RoHS Compliant: Yes; REACH SVHC: No SVHC; ComponentLink1URL: https://datasheet.ciiva.com/14142/b3s-eng-datasheet-14142433.pdf?src-supplier=Distrelec; ComponentLink1Description: https://datasheet.ciiva.com/14142/b3s-eng-datasheet-14142433.pdf?src-supplier=Distrelec; ComponentLink2URL: https://datasheet.ciiva.com/20148/78-0141-20148379.pdf?src-supplier=Rapid+Electronics; ComponentLink2Description: https://datasheet.ciiva.com/20148/78-0141-20148379.pdf?src-supplier=Rapid+Electronics; ComponentLink3URL: https://datasheet.ciiva.com/26883/getdatasheetpartid-240626-26883382.pdf?src-supplier=Verical; ComponentLink3Description: https://datasheet.ciiva.com/26883/getdatasheetpartid-240626-26883382.pdf?src-supplier=Verical; ComponentLink4URL: https://datasheet.ciiva.com/2900/b3s-1110-2900062.pdf?src-supplier=Digi-Key; ComponentLink4Description: https://datasheet.ciiva.com/2900/b3s-1110-2900062.pdf?src-supplier=Digi-Key; ComponentLink5URL: https://datasheet.ciiva.com/14539/70175262-14539005.pdf?src-supplier=Allied+Electronics; ComponentLink5Description: https://datasheet.ciiva.com/14539/70175262-14539005.pdf?src-supplier=Allied+Electronics; ComponentLink6URL: https://datasheet.ciiva.com/16155/en-b3s-16155005.pdf?src-supplier=Onlinecomponents.com; ComponentLink6Description: https://datasheet.ciiva.com/16155/en-b3s-16155005.pdf?src-supplier=Onlinecomponents.com; ComponentLink7URL: https://datasheet.ciiva.com/1532/1683347-1532667.pdf?src-supplier=Element14; ComponentLink7Description: https://datasheet.ciiva.com/1532/1683347-1532667.pdf?src-supplier=Element14; ComponentLink8URL: https://datasheet.ciiva.com/30227/en-b3s-30227246.pdf?src-supplier=Onlinecomponents.com; ComponentLink8Description: https://datasheet.ciiva.com/30227/en-b3s-30227246.pdf?src-supplier=Onlinecomponents.com; Supplier Part Number 1: SW415-ND
U1 = LM4F120H5QRFIG: MCU 32-bit Stellaris ARM Cortex M4F RISC 256KB Flash 1.2V/3.3V 64-Pin LQFP Tray; Manufacturer: Texas Instruments; RAM Size: 32KB; Max Power Dissipation: 560mW; Interface: I2C,USB,CAN,UART; Number of Timers/Counters: 13; Data Bus Width: 32b; Number of Programmable I/O: 43; Watchdog Timer: Yes; Max Frequency: 80MHz; Supplier 1: Arrow Electronics; Manufacturer Part Number: LM4F120H5QRFIG; Stock 1: 0; RoHS: Yes; Case/Package: LQFP; Min Operating Temperature: -40°C; Max Operating Temperature: 85°C; Packaging: Tray; Memory Type: FLASH; Memory Size: 256KB; Core Architecture: ARM; Radiation Hardening: No; RoHS Compliant: Yes; ComponentLink1URL: http://www.ti.com/lit/ds/symlink/lm4f120h5qr.pdf?src-supplier=Avnet; ComponentLink1Description: http://www.ti.com/lit/ds/symlink/lm4f120h5qr.pdf?src-supplier=Avnet; Supplier Part Number 1: LM4F120H5QRFIG
U2 = TLV803MDBZR: 3-pin voltage supervisor (reset IC) with active-low and open-drain reset 3-SOT-23 -40 to 125; Manufacturer: Texas Instruments; Max Supply Voltage: 6V; Min Supply Voltage: 1.1V; Max Supply Current: 30uA; Watchdog Timer: No; Max Reset Threshold Voltage: 4.48V; Min Reset Threshold Voltage: 4.28V; Number of Voltages Monitored: 1; Reset: Active Low; Reset Timeout: 120ms; Threshold Voltage: 4.38V; Operating Supply Current: 20uA; Quiescent Current: 9uA; Supplier 1: Digi-Key; Manufacturer Part Number: TLV803MDBZR; Stock 1: 0; Pricing 1: 1 = 0.79000, 10 = 0.69600, 25 = 0.65400, 100 = 0.53370, 250 = 0.49572, 500 = 0.42188, 1000 = 0.34825 (USD); RoHS: Yes; Case/Package: SOT-23; Number of Pins: 3; Min Operating Temperature: -40°C; Max Operating Temperature: 125°C; Packaging: Tape and Reel; Package Quantity: 3000; Nominal Supply Current: 30uA; Number of Elements: 1; Series: TLV803M; Supply Current: 30uA; Radiation Hardening: No; REACH SVHC: No SVHC; Lead Free: Lead Free; RoHS Compliant: Yes; ComponentLink1URL: https://datasheet.ciiva.com/1979/tlv803m-1979835.pdf?src-supplier=Digi-Key; ComponentLink1Description: https://datasheet.ciiva.com/1979/tlv803m-1979835.pdf?src-supplier=Digi-Key; ComponentLink2URL: https://datasheet.ciiva.com/1979/tlv803m-1979836.pdf?src-supplier=Digi-Key; ComponentLink2Description: https://datasheet.ciiva.com/1979/tlv803m-1979836.pdf?src-supplier=Digi-Key; ComponentLink3URL: https://datasheet.ciiva.com/14203/tlv863m-14203541.pdf?src-supplier=Avnet; ComponentLink3Description: https://datasheet.ciiva.com/14203/tlv863m-14203541.pdf?src-supplier=Avnet; Supplier Part Number 1: 296-29194-1-ND
U3 = TPS73633DRBT: LDO Regulator Pos 3.3V 0.4A 8-Pin VSON EP T/R; Manufacturer: Texas Instruments; Dropout Voltage: 75mV; Number of Outputs: 1; Output Current: 400mA; Max Power Dissipation: 2.5W; Max Input Voltage: 5.5V; Min Input Voltage: 1.7V; Input Bias Current: 300uA; Polarity: Positive; Accuracy: 1%; Output Voltage Accuracy: 0.5%; Output Type: Fixed; Supplier 1: Digi-Key; Manufacturer Part Number: TPS73633DRBT; Stock 1: 0; Pricing 1: 1 = 2.87000, 10 = 2.57600, 25 = 2.43520, 100 = 2.11040 (USD); RoHS: Yes; Case/Package: VSON; Number of Pins: 8; Min Operating Temperature: -40°C; Max Operating Temperature: 125°C; Package Quantity: 250; Packaging: Tape and Reel; Output Voltage: 3.3V; Max Output Current: 400mA; Number of Regulators: 1; Min Current Limit: 400mA; Power Dissipation: 2.5W; Quiescent Current: 300uA; Max Output Voltage: 3.3V; Min Output Voltage: 3.3V; Series: -; Radiation Hardening: No; Lead Free: Lead Free; RoHS Compliant: Yes; ComponentLink1URL: https://datasheet.ciiva.com/15111/getdatasheetpartid-48105-15111075.pdf?src-supplier=Verical; ComponentLink1Description: https://datasheet.ciiva.com/15111/getdatasheetpartid-48105-15111075.pdf?src-supplier=Verical; Supplier Part Number 1: 296-32558-1-ND
Y1 = AB26TRB-32.768KHZ-T: Crystal, Cylindrical 32.768Khz, 12.5F, 20Ppm, 2 X 6 Formed Lead Smd Rohs Compliant: Yes; Manufacturer: Abracon; Load Capacitance: 12.5pF; Series Resistance: 50kR; Frequency Stability: -0.034ppm; Supplier 1: Digi-Key; Manufacturer Part Number: AB26TRB-32.768KHZ-T; Stock 1: 61676; Pricing 1: 1 = 0.65000, 10 = 0.57400, 50 = 0.53660, 100 = 0.47420, 500 = 0.44928, 1000 = 0.37440 (USD); RoHS: Yes; Mount: Surface Mount; Case/Package: Radial; Number of Pins: 2; Min Operating Temperature: -40°C; Max Operating Temperature: 85°C; Frequency: 32.768kHz; Frequency Tolerance: 20ppm; Packaging: Tape and Reel; ESR (Equivalent Series Resistance): 50kR; Package Quantity: 500; Tolerance: 20ppm; Termination: Radial; Series: AB26TRB; Operating Frequency: 32.768 kHz; Length: 6mm; Height: 0.075inch; Lead Pitch: 2.54mm; Depth: 1.9mm; REACH SVHC: No SVHC; Lead Free: Lead Free; ComponentLink1URL: https://datasheet.ciiva.com/4945/ab26tr-30941-4945140.pdf?src-supplier=Mouser; ComponentLink1Description: https://datasheet.ciiva.com/4945/ab26tr-30941-4945140.pdf?src-supplier=Mouser; ComponentLink2URL: https://datasheet.ciiva.com/1357/ab26tr-1357201.pdf?src-supplier=Element14; ComponentLink2Description: https://datasheet.ciiva.com/1357/ab26tr-1357201.pdf?src-supplier=Element14; ComponentLink3URL: https://datasheet.ciiva.com/854/ab26trb-854381.pdf?src-supplier=Digi-Key; ComponentLink3Description: https://datasheet.ciiva.com/854/ab26trb-854381.pdf?src-supplier=Digi-Key; ComponentLink4URL: https://datasheet.ciiva.com/854/ab26trb-854382.pdf?src-supplier=Digi-Key; ComponentLink4Description: https://datasheet.ciiva.com/854/ab26trb-854382.pdf?src-supplier=Digi-Key; ComponentLink5URL: https://datasheet.ciiva.com/854/ab26trb-854383.pdf?src-supplier=Digi-Key; ComponentLink5Description: https://datasheet.ciiva.com/854/ab26trb-854383.pdf?src-supplier=Digi-Key; ComponentLink6URL: https://datasheet.ciiva.com/3174/ab26trb-3174233.pdf?src-supplier=Avnet; ComponentLink6Description: https://datasheet.ciiva.com/3174/ab26trb-3174233.pdf?src-supplier=Avnet; ComponentLink7URL: https://datasheet.ciiva.com/16215/ab26trb-16215317.pdf?src-supplier=Future+Electronics; ComponentLink7Description: https://datasheet.ciiva.com/16215/ab26trb-16215317.pdf?src-supplier=Future+Electronics; ComponentLink8URL: https://datasheet.ciiva.com/28508/270658-28508373.pdf?src-supplier=Element14; ComponentLink8Description: https://datasheet.ciiva.com/28508/270658-28508373.pdf?src-supplier=Element14; Supplier Part Number 1: 535-9033-1-ND
Y2 = ABM3-16.000MHZ-B2-T: Crystal 16MHz ±20ppm (Tol) ±50ppm (Stability) 18pF FUND 40Ohm 2-Pin Mini-CSMD T/R; Manufacturer: Abracon; ESR (Equivalent Series Resistance): 40R; Series Resistance: 60R; Supplier 1: Newark; Manufacturer Part Number: ABM3-16.000MHZ-B2-T; Stock 1: 928; Pricing 1: 1 = 0.92700, 10 = 0.88000 (USD); RoHS: Yes; Mount: Surface Mount; Case/Package: CSMD; Number of Pins: 2; Min Operating Temperature: -20°C; Max Operating Temperature: 70°C; Frequency: 16MHz; Load Capacitance: 18pF; Packaging: Tape and Reel; Frequency Tolerance: 20ppm; Package Quantity: 1000; Tolerance: 20ppm; Frequency Stability: 50ppm; Termination: SMD/SMT; Resistor Type: Ceramic; Accuracy: 20ppm; Series: ABM3; Operating Frequency: 16 MHz; Length: 5mm; Width: 3.2mm; Height: 0.051inch; Depth: 3.2mm; REACH SVHC: Yes; Lead Free: Lead Free; ComponentLink1URL: https://datasheet.ciiva.com/15116/getdatasheetpartid-719852-15116752.pdf?src-supplier=Verical; ComponentLink1Description: https://datasheet.ciiva.com/15116/getdatasheetpartid-719852-15116752.pdf?src-supplier=Verical; ComponentLink2URL: https://datasheet.ciiva.com/855/abm3-855737.pdf?src-supplier=Digi-Key; ComponentLink2Description: https://datasheet.ciiva.com/855/abm3-855737.pdf?src-supplier=Digi-Key; ComponentLink3URL: https://datasheet.ciiva.com/855/abm3-855738.pdf?src-supplier=Digi-Key; ComponentLink3Description: https://datasheet.ciiva.com/855/abm3-855738.pdf?src-supplier=Digi-Key; ComponentLink4URL: https://datasheet.ciiva.com/855/abm3-855739.pdf?src-supplier=Digi-Key; ComponentLink4Description: https://datasheet.ciiva.com/855/abm3-855739.pdf?src-supplier=Digi-Key; ComponentLink5URL: https://datasheet.ciiva.com/4945/abm3-47699-4945240.pdf?src-supplier=Mouser; ComponentLink5Description: https://datasheet.ciiva.com/4945/abm3-47699-4945240.pdf?src-supplier=Mouser; ComponentLink6URL: https://datasheet.ciiva.com/16209/abm3-16209965.pdf?src-supplier=Future+Electronics; ComponentLink6Description: https://datasheet.ciiva.com/16209/abm3-16209965.pdf?src-supplier=Future+Electronics; Supplier Part Number 1: 13J1720